# EAGLE design femto-beacon-esp32coin (EAGLE 9.3.0)

## Sheet 1 of 3
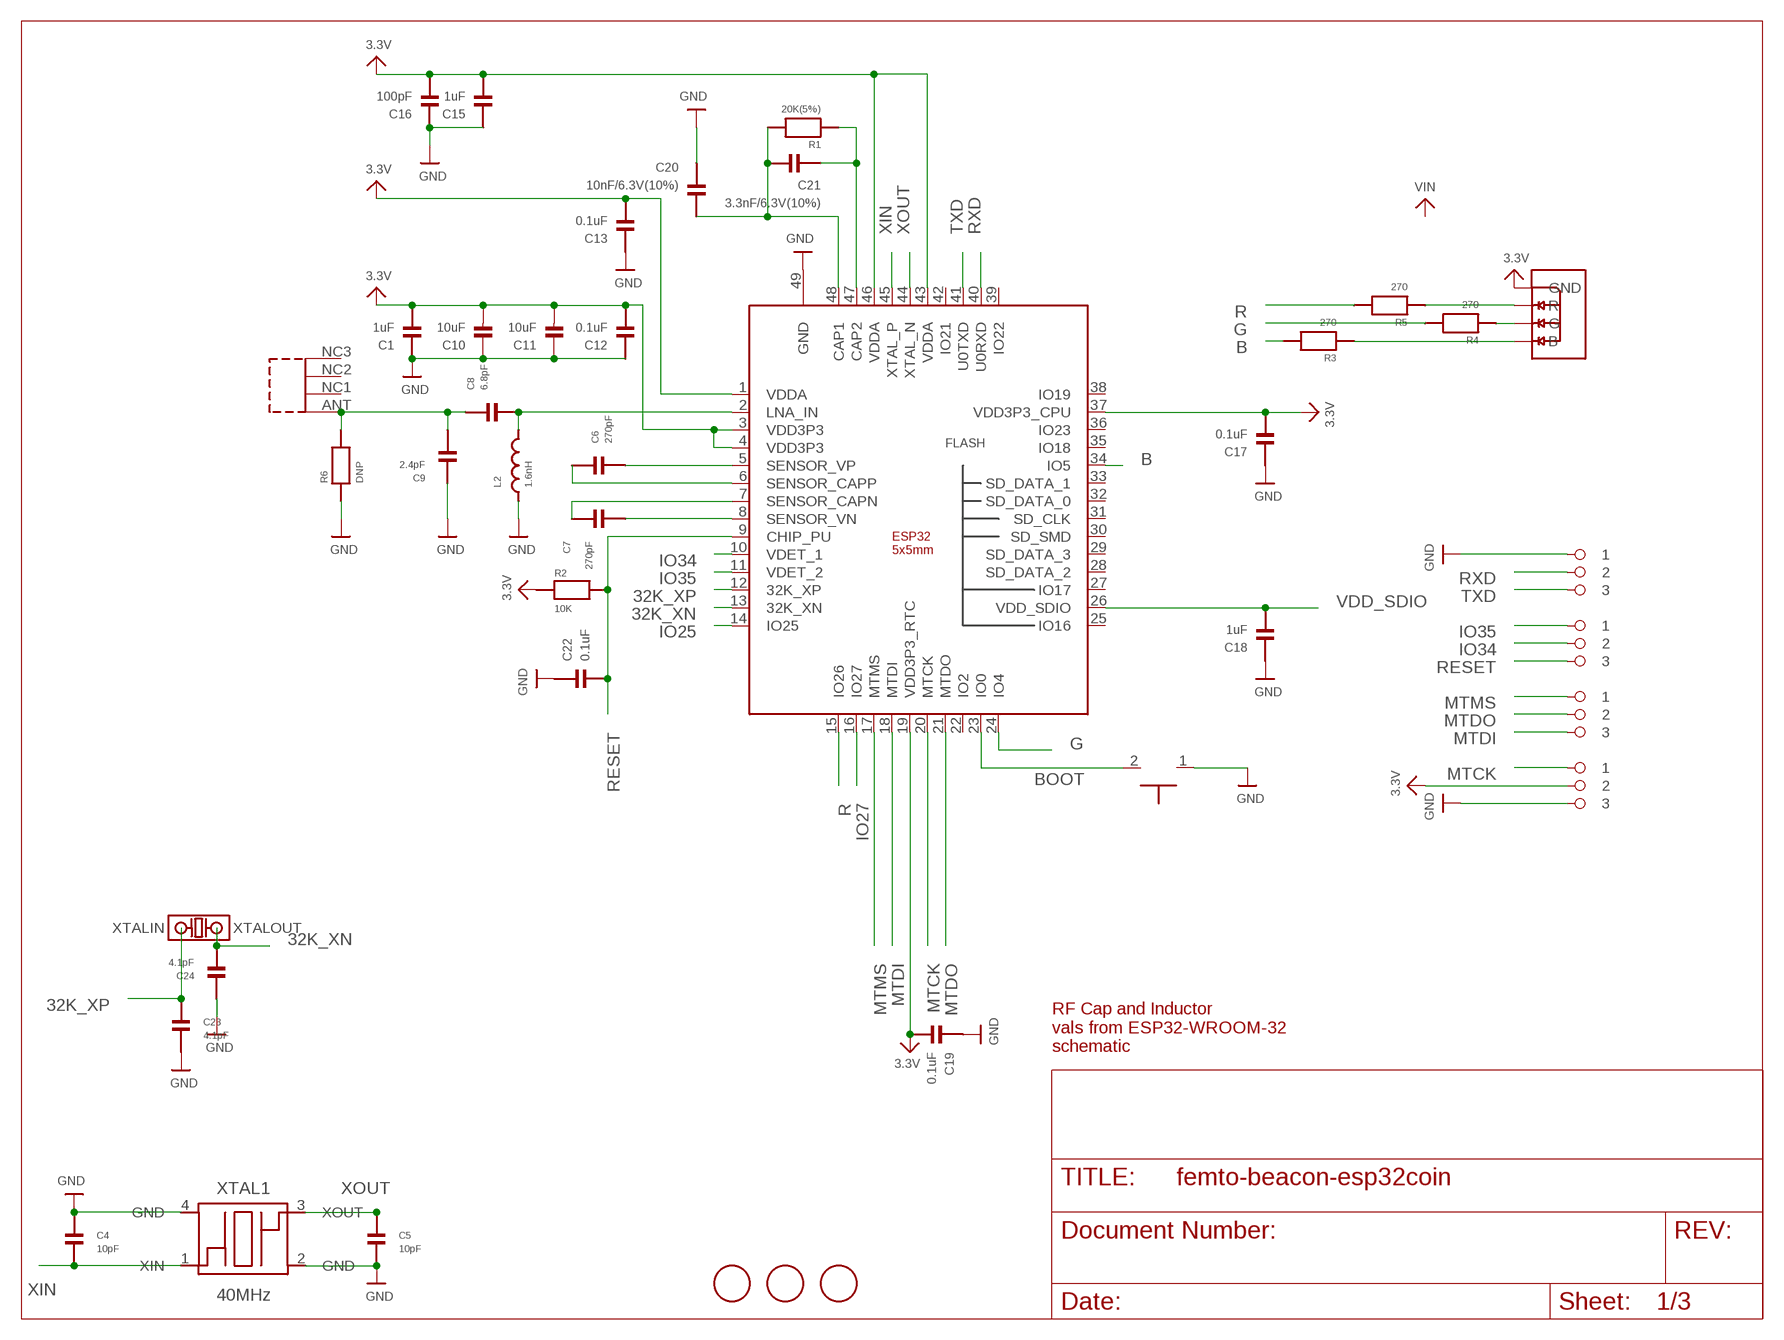
[diagram p0: schematic, sheet 1]

### Parts
ANT1  0479480001  [0479480001]
BOOT1  TACTILE_SWITCH_NO_GND_NO_BOSS  [SIDE_ACT_NO_GND_NO_BOSS]
C1  1uF  CAPACITOR_0201  [PART]
C4  10pF  CAPACITOR_0201  [PART]
C5  10pF  CAPACITOR_0201  [PART]
C6  270pF  CAPACITOR_0201  [PART]
C7  270pF  CAPACITOR_0201  [PART]
C8  6.8pF  CAPACITOR_0201  [PART]
C9  2.4pF  CAPACITOR_0201  [PART]
C10  10uF  CAP_CERAMIC_0603MP  [_0603MP]
C11  10uF  CAP_CERAMIC_0603MP  [_0603MP]
C12  0.1uF  CAPACITOR_0201  [PART]
C13  0.1uF  CAPACITOR_0201  [PART]
C15  1uF  CAPACITOR_0201  [PART]
C16  100pF  CAPACITOR_0201  [PART]
C17  0.1uF  CAPACITOR_0201  [PART]
C18  1uF  CAPACITOR_0201  [PART]
C19  0.1uF  CAPACITOR_0201  [PART]
C20  10nF/6.3V(10%)  CAPACITOR_0201  [PART]
C21  3.3nF/6.3V(10%)  CAPACITOR_0201  [PART]
C22  0.1uF  CAPACITOR_0201  [PART]
C23  4.1pF  CAPACITOR_0201  [PART]
C24  4.1pF  CAPACITOR_0201  [PART]
FID1  FIDUCIAL  [FIDUCIAL_1MM]
FID2  FIDUCIAL  [FIDUCIAL_1MM]
FID3  FIDUCIAL  [FIDUCIAL_1MM]
IC1  ESP32-QFN_5X5  [ESP32-QFN48_5X5]
L2  1.6nH  INDUCTOR_FIXED_0201  [PART]
PIN_EN  1X3_ROUND  [1X3_ROUND]
PIN_GPIO_A  1X3_ROUND  [1X3_ROUND]
PIN_GPIO_B  1X3_ROUND  [1X3_ROUND]
PIN_UART  1X3_ROUND  [1X3_ROUND]
R1  20K(5%)  RESISTOR_0201  [PART]
R2  10K  RESISTOR_0201  [PART]
R3  270  RESISTOR_0201  [PART]
R4  270  RESISTOR_0201  [PART]
R5  270  RESISTOR_0201  [PART]
R6  DNP  RESISTOR_0201  [PART]
RGB1  LRTB_R48G  [LRTB_R48G]
XTAL1  40MHz  FA-128  [FA-128]
XTAL2  ABS06-107-32.768KHZ-T  [ABS06-107-32.768KHZ-T]

### Nets
3.3V: C1.2 C10.2 C11.2 C12.2 C13.2 C15.2 C16.2 C17.2 C19.2 IC1.1(VDDA) IC1.3(VDD3P3) IC1.4(VDD3P3) IC1.19(VDD3P3_RTC) IC1.37(VDD3P3_CPU) IC1.43(VDDA) IC1.46(VDDA) PIN_GPIO_A.P$2 R2.1 RGB1.1(GND) ; also sheet 2
32K_XN: C24.1 IC1.13(32K_XN) XTAL2.2(XTALOUT)
32K_XP: C23.2 IC1.12(32K_XP) XTAL2.1(XTALIN)
ANT: C8.2 IC1.2(LNA_IN) L2.2
B: IC1.34(IO5) R3.2
B_: R3.1 RGB1.4(B)
BOOT: BOOT1.2 IC1.23(IO0)
G: IC1.24(IO4) R4.2
G_: R4.1 RGB1.3(G)
GND: BOOT1.1 C1.1 C4.1 C5.1 C9.1 C10.1 C11.1 C12.1 C13.1 C15.1 C16.1 C17.1 C18.1 C19.1 C20.1 C22.1 C23.1 C24.2 IC1.49(GND) L2.1 PIN_GPIO_A.P$3 PIN_UART.P$1 R6.1 XTAL1.2(GND) XTAL1.4(GND) ; also sheet 2
IO25: IC1.14(IO25)
IO27: IC1.16(IO27)
IO34: IC1.10(VDET_1) PIN_EN.P$2
IO35: IC1.11(VDET_2) PIN_EN.P$1
MTCK: IC1.20(MTCK) PIN_GPIO_A.P$1
MTDI: IC1.18(MTDI) PIN_GPIO_B.P$3
MTDO: IC1.21(MTDO) PIN_GPIO_B.P$2
MTMS: IC1.17(MTMS) PIN_GPIO_B.P$1
N$1: C6.1 IC1.5(SENSOR_VP)
N$2: C6.2 IC1.6(SENSOR_CAPP)
N$3: C7.2 IC1.8(SENSOR_VN)
N$4: C7.1 IC1.7(SENSOR_CAPN)
N$6: ANT1.ANT C8.1 C9.2 R6.2
N$7: C21.2 IC1.47(CAP2) R1.1
N$9: C20.2 C21.1 IC1.48(CAP1) R1.2
R: IC1.15(IO26) R5.2
R_: R5.1 RGB1.2(R)
RESET: C22.2 IC1.9(CHIP_PU) PIN_EN.P$3 R2.2
RXD: IC1.40(U0RXD) PIN_UART.P$2
TXD: IC1.41(U0TXD) PIN_UART.P$3
VDD_SDIO: C18.2 IC1.26(VDD_SDIO)
XIN: C4.2 IC1.45(XTAL_P) XTAL1.1(XIN)
XOUT: C5.2 IC1.44(XTAL_N) XTAL1.3(XOUT)
Unconnected: ANT1.NC1 ANT1.NC2 ANT1.NC3 IC1.22(IO2) IC1.25(IO16) IC1.27(IO17) IC1.28(SD_DATA_2) IC1.29(SD_DATA_3) IC1.30(SD_SMD) IC1.31(SD_CLK) IC1.32(SD_DATA_0) IC1.33(SD_DATA_1) IC1.35(IO18) IC1.36(IO23) IC1.38(IO19) IC1.39(IO22) IC1.42(IO21)

### Notes on the sheet
- RF Cap and Inductor
  vals from ESP32-WROOM-32
  schematic

## Sheet 2 of 3
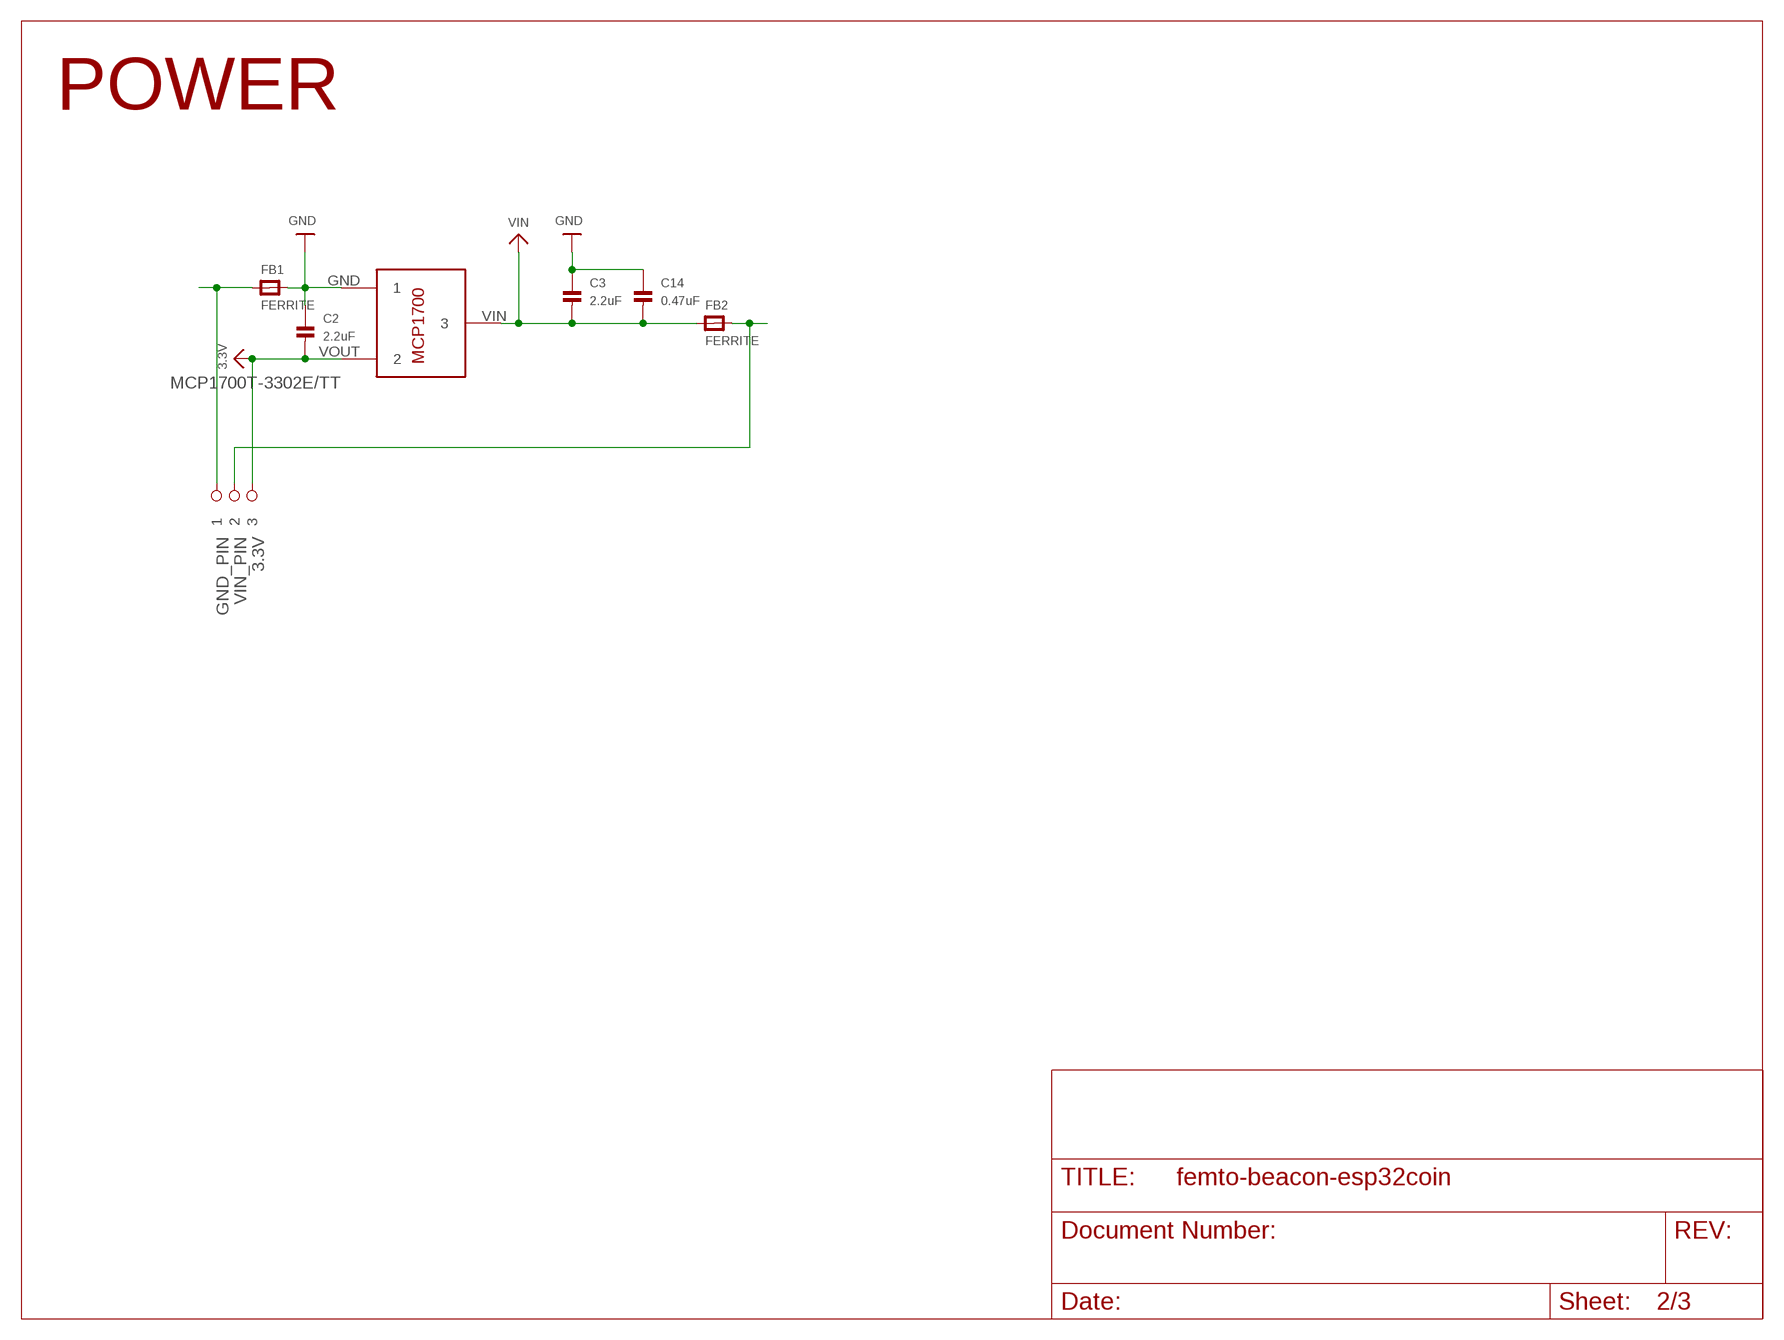
[diagram p1: schematic, sheet 2]

### Parts
C2  2.2uF  CAP_CERAMIC_0402MP  [_0402MP]
C3  2.2uF  CAP_CERAMIC_0402MP  [_0402MP]
C14  0.47uF  CAP_CERAMIC_0402MP  [_0402MP]
FB1  FERRITE  FERRITE_0603MP  [_0603MP]
FB2  FERRITE  FERRITE_0603MP  [_0603MP]
LDO1  MCP1700T-3302E/TT  [MCP1700T-3302E/TT]
PIN_PWR  1X3_ROUND  [1X3_ROUND]

### Nets
3.3V: C2.2 LDO1.VOUT PIN_PWR.P$3 ; also sheet 1
GND: C2.1 C3.1 C14.1 FB1.2 LDO1.GND ; also sheet 1
GND_PIN: FB1.1 PIN_PWR.P$1
VIN: C3.2 C14.2 FB2.1 LDO1.VIN
VIN_PIN: FB2.2 PIN_PWR.P$2

### Notes on the sheet
- POWER

## Sheet 3 of 3
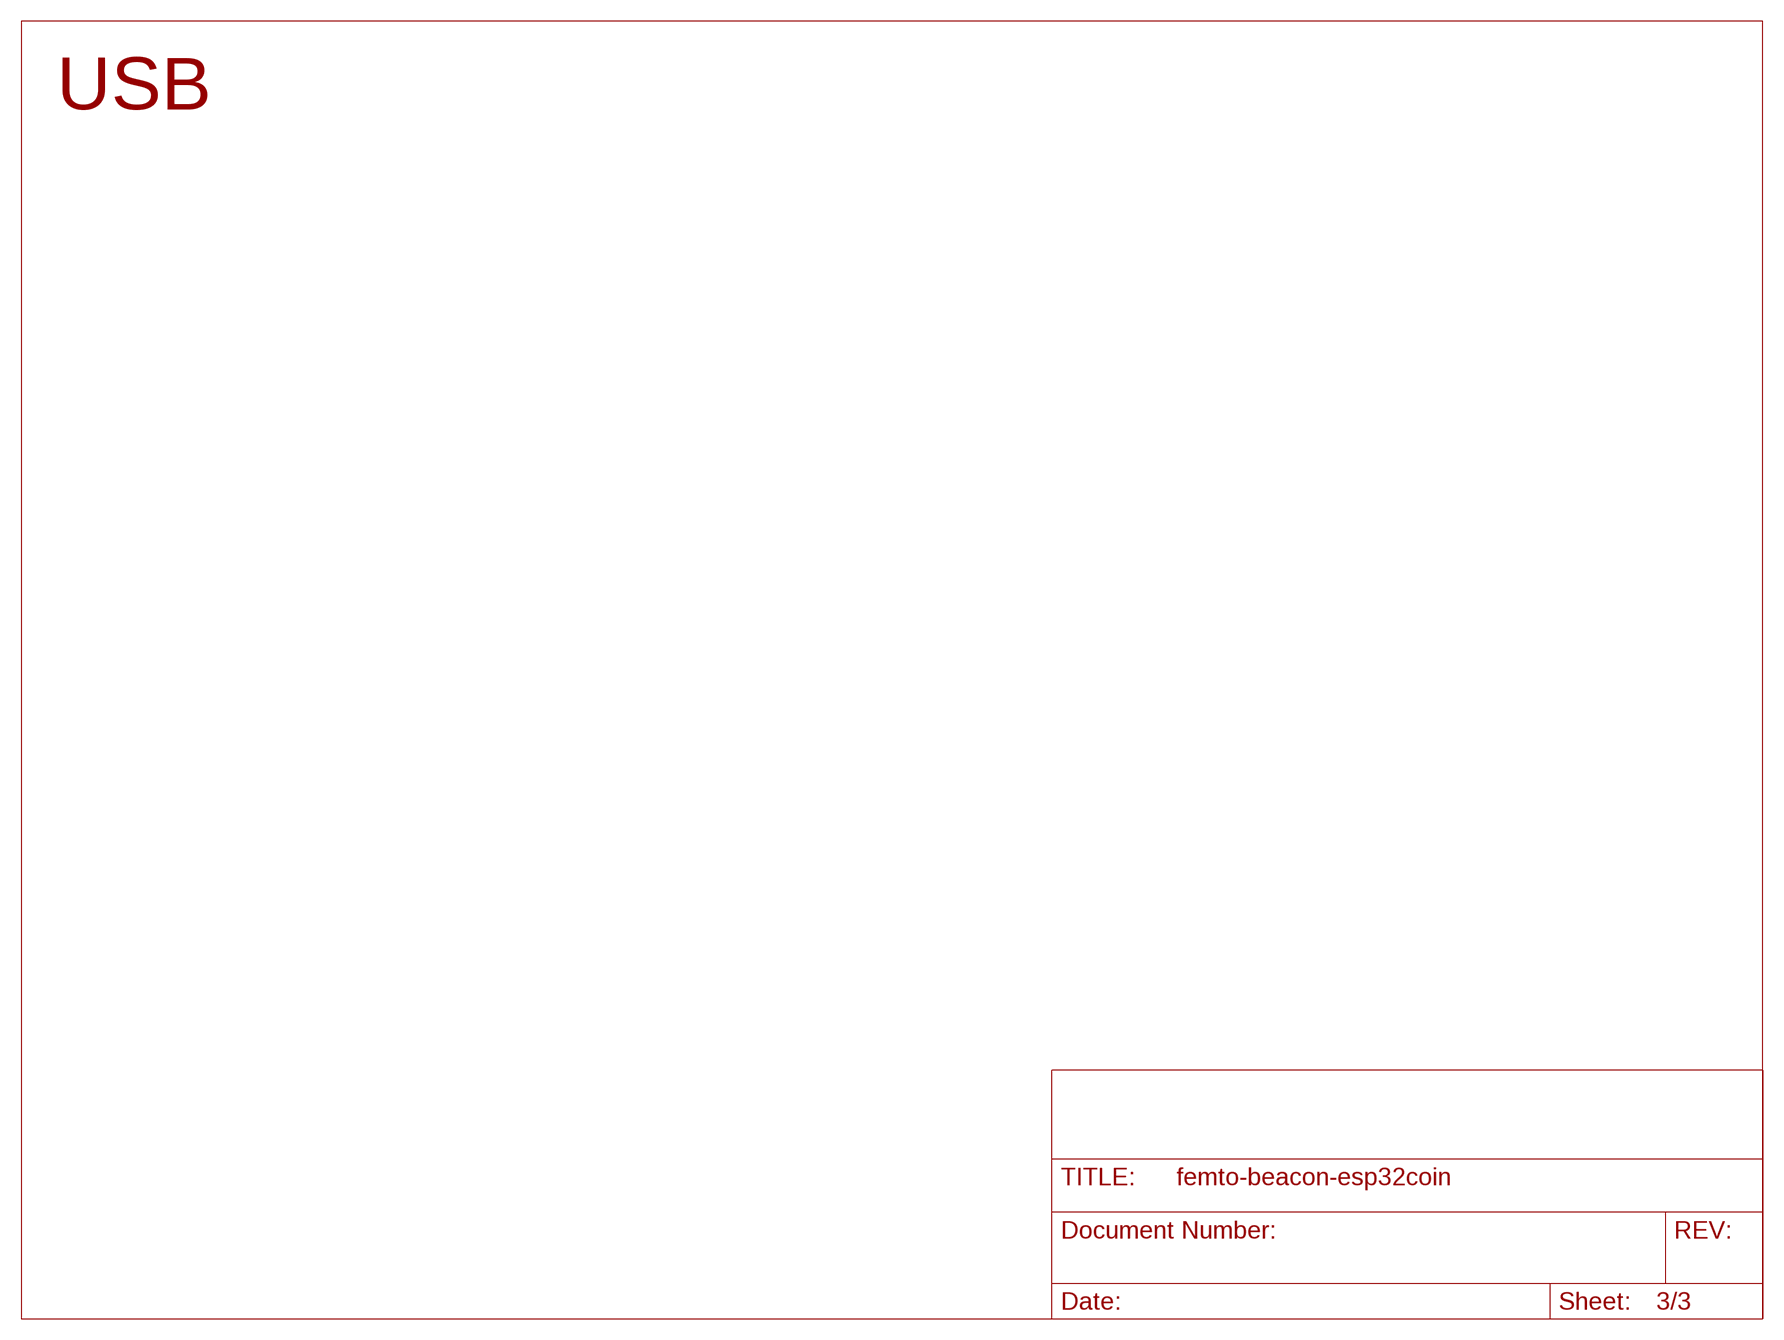
[diagram p2: schematic, sheet 3]

### Notes on the sheet
- USB

## Library data of the parts
ANT1 = molex-antenna-2.4GHz:0479480001: Molex 2.4GHz SMD tower antenna.; MPN: 0479480001
BOOT1 = omron_tactile_switch:TACTILE_SWITCH_NO_GND_NO_BOSS: Omron tactile switch; MPN: B3U-3000P
C1 C15 C18 = parts_0201:CAPACITOR_0201; MPN: CL03A105KQ3CSNH
C2 C3 = microbuilder:CAP_CERAMIC: Ceramic Capacitors 0402 - 0402 Surface Mount Capacitors 16pF 50V 5% [Digikey: 445-4899-2-ND] 18pF 50V 5% [Digikey: 490-1281-2-ND] 22pF 50V 5% [Digikey: 490-1283-2-ND] 68pF 50V 5% [Digikey: 490-1289-2-ND] 0.1uF 10V 10% [Digikey: 490-1318-2-ND] 1.0uF 6.3V 10% [Digikey: 490-1320-2-ND] 0603 - 0603 Surface Mount Capacitors 16 pF 50V 5% [Digikey: 445-5051-2-ND] 22 pF 50V [Digikey: PCC220ACVTR-ND] 33 pF 50V 5% [Digikey: 490-1415-1-ND] 56pF 50V 5% [Digikey: 490-1421-1-ND] 220pF 50V 5% [Digikey: 445-1285-1-ND] 680 pF 50V 2200 pF 50V 5% C0G [Digikey: 445-1297-1-ND] 5600 pF 100V 5% X7R [Digikey: 478-3711-1-ND] 0.1 µF 25V 10% [Digikey: PCC2277TR-ND] 0.22 µF 16V 10% X7R [Digikey: 445-1318-1-ND] 1.0 µF 25V 10% [Digikey: 445-5146-2-ND] 0603 - RF Specific 3pF 250V +/-0.1pF RF [Digikey: 712-1347-1-ND] 18 pF 250V 5% [Digikey: 478-3505-1-ND or 712-1322-1-ND] 56 pF 250V 5% C0G RF [Digikey: 490-4867-1-ND] 68 pF 250V RF [Digikey: 490-4868-1-ND] 0805 - 0805 Surface Mount Capacitors 220 pF 250V 2% RF Ceramic Capacitor [Digikey: 712-1398-1-ND] 1000 pF 50V 2% NP0 Ceramic Capacitor [Digikey: 478-3760-1-ND] 0.1 µF 25V 10% Ceramic Capacitor [Digikey: PCC1828TR-ND] 1.0 µF 16V 10% Ceramic Capacitor[Digikey: 490-1691-2-ND] 10.0 µF 10V 10% Ceramic Capacitor[Digikey: 709-1228-1-ND] 10.0 uF 16V 10% Ceramic Capacitor [Digikey: 478-5165-2-ND] 47 uF 6.3V 20% Ceramic Capacitor [Digikey: 587-1779-1-ND or 399-5506-1-ND] 1206 - 1206 Surface Mount Capacitors 47uF 10V 20% Ceramic Capacitor [Digikey: 490-5528-1-ND or 399-5508-1-ND or 445-6010-1-ND] 100uF 6.3V -20%, +80% Y5V Ceramic Capacitor (Digikey: 490-4512-1-ND, Mouser: 81-GRM31CF50J107ZE1L); MPN: C1005X5R0J225K050BC
C4 C5 = parts_0201:CAPACITOR_0201; MPN: 02013A100JAT2A
C6 C7 = parts_0201:CAPACITOR_0201; MPN: GRM033R71C271KA01D
C8 = parts_0201:CAPACITOR_0201; MPN: GRM0335C2A6R8DA01D
C9 = parts_0201:CAPACITOR_0201; MPN: GRM0335C1H2R4CA01D
C10 C11 = microbuilder:CAP_CERAMIC: Ceramic Capacitors 0402 - 0402 Surface Mount Capacitors 16pF 50V 5% [Digikey: 445-4899-2-ND] 18pF 50V 5% [Digikey: 490-1281-2-ND] 22pF 50V 5% [Digikey: 490-1283-2-ND] 68pF 50V 5% [Digikey: 490-1289-2-ND] 0.1uF 10V 10% [Digikey: 490-1318-2-ND] 1.0uF 6.3V 10% [Digikey: 490-1320-2-ND] 0603 - 0603 Surface Mount Capacitors 16 pF 50V 5% [Digikey: 445-5051-2-ND] 22 pF 50V [Digikey: PCC220ACVTR-ND] 33 pF 50V 5% [Digikey: 490-1415-1-ND] 56pF 50V 5% [Digikey: 490-1421-1-ND] 220pF 50V 5% [Digikey: 445-1285-1-ND] 680 pF 50V 2200 pF 50V 5% C0G [Digikey: 445-1297-1-ND] 5600 pF 100V 5% X7R [Digikey: 478-3711-1-ND] 0.1 µF 25V 10% [Digikey: PCC2277TR-ND] 0.22 µF 16V 10% X7R [Digikey: 445-1318-1-ND] 1.0 µF 25V 10% [Digikey: 445-5146-2-ND] 0603 - RF Specific 3pF 250V +/-0.1pF RF [Digikey: 712-1347-1-ND] 18 pF 250V 5% [Digikey: 478-3505-1-ND or 712-1322-1-ND] 56 pF 250V 5% C0G RF [Digikey: 490-4867-1-ND] 68 pF 250V RF [Digikey: 490-4868-1-ND] 0805 - 0805 Surface Mount Capacitors 220 pF 250V 2% RF Ceramic Capacitor [Digikey: 712-1398-1-ND] 1000 pF 50V 2% NP0 Ceramic Capacitor [Digikey: 478-3760-1-ND] 0.1 µF 25V 10% Ceramic Capacitor [Digikey: PCC1828TR-ND] 1.0 µF 16V 10% Ceramic Capacitor[Digikey: 490-1691-2-ND] 10.0 µF 10V 10% Ceramic Capacitor[Digikey: 709-1228-1-ND] 10.0 uF 16V 10% Ceramic Capacitor [Digikey: 478-5165-2-ND] 47 uF 6.3V 20% Ceramic Capacitor [Digikey: 587-1779-1-ND or 399-5506-1-ND] 1206 - 1206 Surface Mount Capacitors 47uF 10V 20% Ceramic Capacitor [Digikey: 490-5528-1-ND or 399-5508-1-ND or 445-6010-1-ND] 100uF 6.3V -20%, +80% Y5V Ceramic Capacitor (Digikey: 490-4512-1-ND, Mouser: 81-GRM31CF50J107ZE1L); MPN: GRM188R61C106KAALD
C12 C13 C17 C19 C22 = parts_0201:CAPACITOR_0201; MPN: GRM033C80J104KE84D
C14 = microbuilder:CAP_CERAMIC: Ceramic Capacitors 0402 - 0402 Surface Mount Capacitors 16pF 50V 5% [Digikey: 445-4899-2-ND] 18pF 50V 5% [Digikey: 490-1281-2-ND] 22pF 50V 5% [Digikey: 490-1283-2-ND] 68pF 50V 5% [Digikey: 490-1289-2-ND] 0.1uF 10V 10% [Digikey: 490-1318-2-ND] 1.0uF 6.3V 10% [Digikey: 490-1320-2-ND] 0603 - 0603 Surface Mount Capacitors 16 pF 50V 5% [Digikey: 445-5051-2-ND] 22 pF 50V [Digikey: PCC220ACVTR-ND] 33 pF 50V 5% [Digikey: 490-1415-1-ND] 56pF 50V 5% [Digikey: 490-1421-1-ND] 220pF 50V 5% [Digikey: 445-1285-1-ND] 680 pF 50V 2200 pF 50V 5% C0G [Digikey: 445-1297-1-ND] 5600 pF 100V 5% X7R [Digikey: 478-3711-1-ND] 0.1 µF 25V 10% [Digikey: PCC2277TR-ND] 0.22 µF 16V 10% X7R [Digikey: 445-1318-1-ND] 1.0 µF 25V 10% [Digikey: 445-5146-2-ND] 0603 - RF Specific 3pF 250V +/-0.1pF RF [Digikey: 712-1347-1-ND] 18 pF 250V 5% [Digikey: 478-3505-1-ND or 712-1322-1-ND] 56 pF 250V 5% C0G RF [Digikey: 490-4867-1-ND] 68 pF 250V RF [Digikey: 490-4868-1-ND] 0805 - 0805 Surface Mount Capacitors 220 pF 250V 2% RF Ceramic Capacitor [Digikey: 712-1398-1-ND] 1000 pF 50V 2% NP0 Ceramic Capacitor [Digikey: 478-3760-1-ND] 0.1 µF 25V 10% Ceramic Capacitor [Digikey: PCC1828TR-ND] 1.0 µF 16V 10% Ceramic Capacitor[Digikey: 490-1691-2-ND] 10.0 µF 10V 10% Ceramic Capacitor[Digikey: 709-1228-1-ND] 10.0 uF 16V 10% Ceramic Capacitor [Digikey: 478-5165-2-ND] 47 uF 6.3V 20% Ceramic Capacitor [Digikey: 587-1779-1-ND or 399-5506-1-ND] 1206 - 1206 Surface Mount Capacitors 47uF 10V 20% Ceramic Capacitor [Digikey: 490-5528-1-ND or 399-5508-1-ND or 445-6010-1-ND] 100uF 6.3V -20%, +80% Y5V Ceramic Capacitor (Digikey: 490-4512-1-ND, Mouser: 81-GRM31CF50J107ZE1L); MPN: GRM155R60J474KE19D
C16 = parts_0201:CAPACITOR_0201; MPN: 0201YC101KAT2A
C20 = parts_0201:CAPACITOR_0201; MPN: GRM033R70J103KA01D
C21 = parts_0201:CAPACITOR_0201; MPN: GRM033R70J332KA01D
C23 C24 = parts_0201:CAPACITOR_0201; MPN: GRM0335C1H4R1BA01D
FB1 FB2 = microbuilder:FERRITE: Ferrite Bead 0603 MMZ1608B121C - 120 Ohm @ 100MHz, 600mA, 0.15 Ohm DC Resistance - Digikey: 445-2164-1-ND BK1608HW121-T - 120 Ohm, 600mA Ferrite Chip - Digikey: 587-1876-2-ND 0805 HZ0805B272R-10 - 2.7K Ohm @ 100MHz, 200mA, 0.8 Ohm DC Resistance - Digikey: 240-2504-1-ND (see also Murata BLM21BD272SN1L) MMZ2012Y152B - 1.5K Ohm @ 100MHz, 500mA, 0.4 Ohm DC Resistance - Digikey: 445-1560-1-ND - Mainly for high frequency (80-400MHz) MMZ2012R102A - 1K Ohm @ 100MHz, 500mA, 0.3 Ohm DC Resistance - Digikey: 445-1555-2-ND - More general purpose (10-200MHz); MPN: BLM18RK102SN1D
FID1-FID3 = adafruit:FIDUCIAL: For use by pick and place machines to calibrate the vision/machine, 1mm By microbuilder.eu
IC1 = esp32-wroom-32:ESP32-QFN_5X5: ESP32-D2WD - has 2 MiB internal flash ESP32-S0WD - has 0 MiB internal flash (requires external SPI flash); MPN: ESP32-D2WD
L2 = parts_0201:INDUCTOR_FIXED_0201; MPN: LQP03HQ1N6B02D
LDO1 = MCP1700T-3302E_TT:MCP1700T-3302E/TT: Microchip LDO "MCP1700" in a 3-Pin SOT-23 package. ID: MCP1700T-3302E/TT; MPN: MCP1700T-3302E/TT
PIN_EN PIN_GPIO_A PIN_GPIO_B PIN_PWR PIN_UART = pins_1.27mm_pitch:1X3_ROUND
R1 = parts_0201:RESISTOR_0201; MPN: RC0201JR-0720KL
R2 = parts_0201:RESISTOR_0201; MPN: RC0201JR-0710KL
R3-R5 = parts_0201:RESISTOR_0201; MPN: RC0201FR-07270RL
R6 = parts_0201:RESISTOR_0201
RGB1 = osram_opto_LED:LRTB_R48G: OSRAM RGB LED; MPN: LRTB R48G
XTAL1 = crystals:FA-128; MPN: FA-128 40.0000MF10Z-K3
XTAL2 = crystals:ABS06-107-32.768KHZ-T: ABS06-107-32.768kHz-T Crystal Oscillator; MPN: ABS06-107-32.768kHz-T

## Board
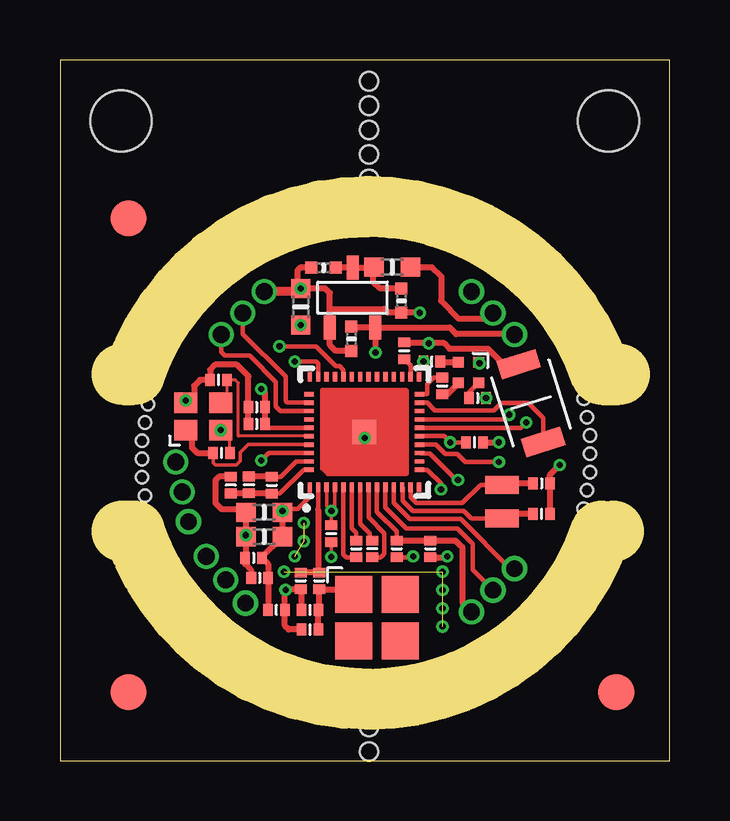
[diagram p3: board, top side]
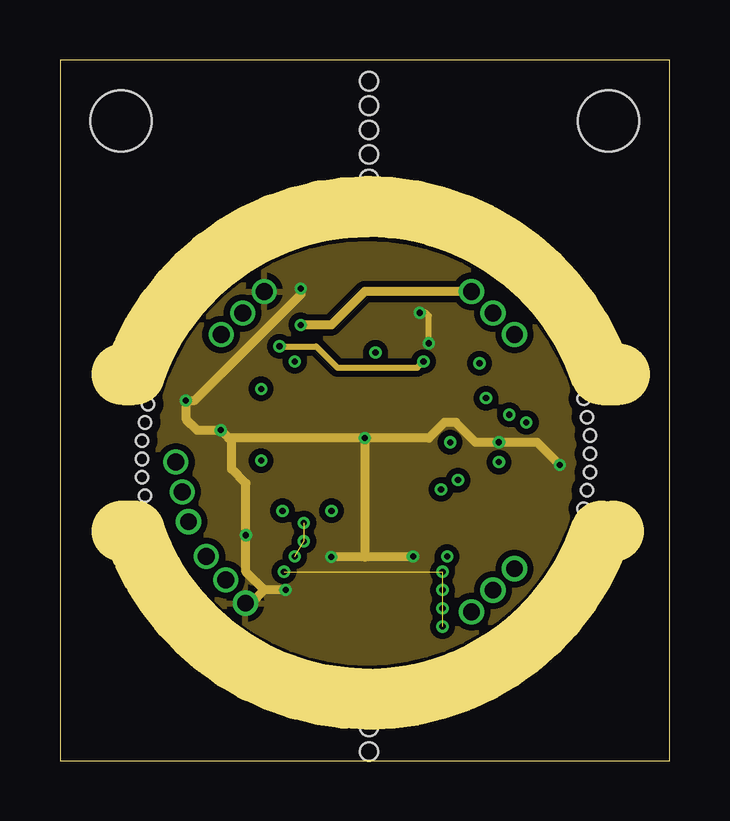
[diagram p4: board, inner layer Route2]
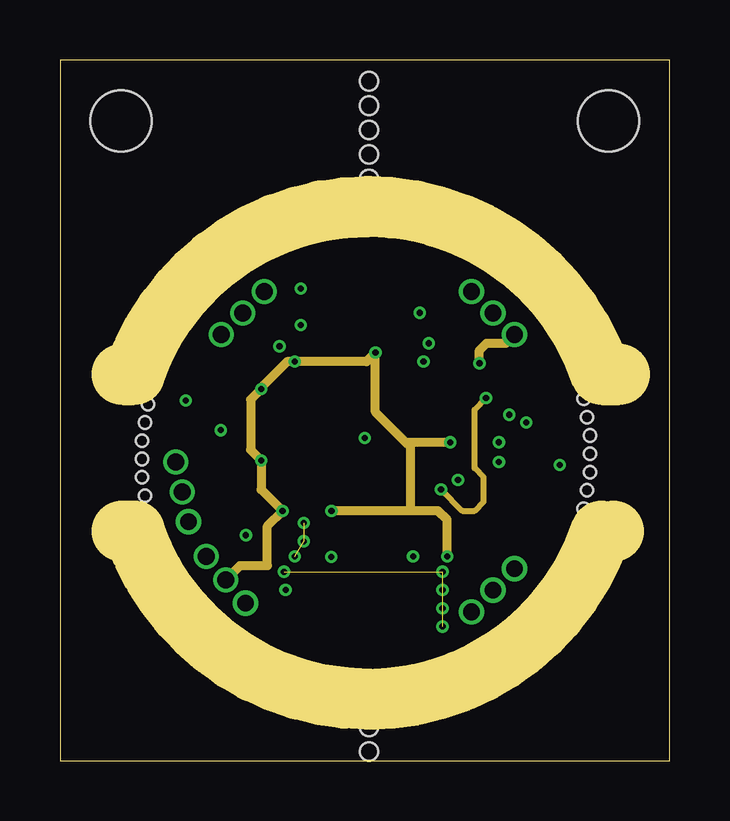
[diagram p5: board, inner layer Route15]
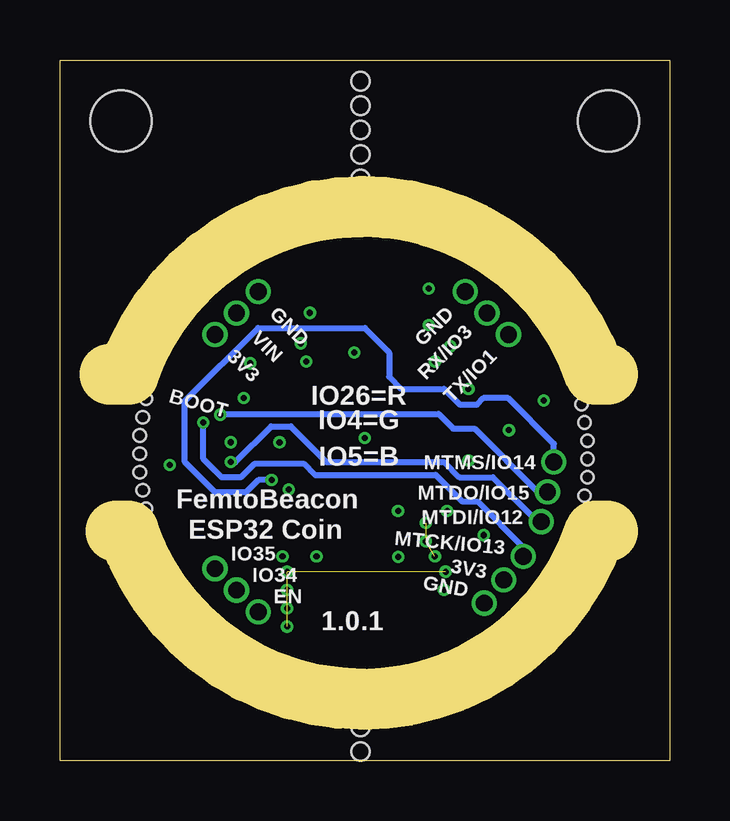
[diagram p6: board, bottom side, seen from below]

Size 25.4 x 29.21 mm. Coordinates in mm from the lower left corner, seen from the top.
Outline: 0,0 25.4,0 25.4,29.21 0,29.21 0,0
Copper layers (1*2*15*16): Top 0.035559375mm / dielectric 0.17018125mm / Route2 0.01778125mm / dielectric 47mil / Route15 0.01778125mm / dielectric 0.17018125mm / Bottom 0.035559375mm
Design rules "oshpark-4layer *": minimum track width 5mil, minimum drill 10mil, track to track 6mil, track to pad 6mil, pad to pad 6mil, via to via 6mil, smd to smd 5mil, copper to edge 15mil, drill to drill 6mil, minimum pad ring 4mil, minimum via ring 4mil, stop-mask expansion 2.5mil, vias tented up to drill 10mil, thermal gap 10mil
Holes 0.51 mm at 22.08,12.79 21.82,15.08 22.08,13.55 22.08,12.03 21.95,14.32 21.82,10.51 21.95,11.27 3.41,12.57 3.67,10.29 3.41,11.81 3.41,13.34 3.54,11.05 3.67,14.86 3.54,14.1
Holes 0.76 mm at 12.87,0.38 12.87,24.26 12.87,1.4 12.87,25.27 12.87,26.29 12.87,27.3 12.87,28.32
Holes 2.54 mm at 22.86,26.67 2.54,26.67
Milling: 8 lines

### Footprints (pad centres in the part's own frame; a part is rotated, then mirrored left to right if it is on the bottom)
0479480001 = smd 1.54 x 1.54: ANT -0.963,0.963; NC1 0.978,0.963; NC2 0.978,-0.978; NC3 -0.963,-0.978
SIDE_ACT_NO_GND_NO_BOSS = smd 0.8 x 1.7: 1 -1.7,0; 2 1.7,0
PART = smd 0.4 x 0.5: 1 -0.35,0; 2 0.35,0
_0402MP = smd 0.5 x 0.5: 1 -0.508,0; 2 0.508,0
_0603MP = smd 0.8 x 0.8: 1 -0.762,0; 2 0.762,0
FIDUCIAL_1MM = smd 1.5 x 1.5: 1 0,0
ESP32-QFN48_5X5 = smd 0.18 x 0.4: 1 -2.275,-2.3; 2 -1.925,-2.3; 3 -1.575,-2.3; 4 -1.225,-2.3; 5 -0.875,-2.3; 6 -0.525,-2.3; 7 -0.175,-2.3; 8 0.175,-2.3; 9 0.525,-2.3; 10 0.875,-2.3; 11 1.225,-2.3; 12 1.575,-2.3; 13 1.925,-2.3; 14 2.275,-2.3; 25 2.275,2.3; 26 1.925,2.3; 27 1.575,2.3; 28 1.225,2.3; 29 0.875,2.3; 30 0.525,2.3; 31 0.175,2.3; 32 -0.175,2.3; 33 -0.525,2.3; 34 -0.875,2.3; 35 -1.225,2.3; 36 -1.575,2.3; 37 -1.925,2.3; 38 -2.275,2.3 | smd 0.4 x 0.18: 15 2.3,-1.575; 16 2.3,-1.225; 17 2.3,-0.875; 18 2.3,-0.525; 19 2.3,-0.175; 20 2.3,0.175; 21 2.3,0.525; 22 2.3,0.875; 23 2.3,1.225; 24 2.3,1.575; 39 -2.3,1.575; 40 -2.3,1.225; 41 -2.3,0.875; 42 -2.3,0.525; 43 -2.3,0.175; 44 -2.3,-0.175; 45 -2.3,-0.525; 46 -2.3,-0.875; 47 -2.3,-1.225; 48 -2.3,-1.575 | smd 1 x 1: 49 0,0
MCP1700T-3302E/TT = smd 0.5 x 1: GND -0.95,-1.25; VIN 0,1.25; VOUT 0.95,-1.25
1X3_ROUND = drill 0.7 pad 1: P$1 0,0; P$2 0,-1.27; P$3 0,-2.54
LRTB_R48G = smd 0.45 x 0.45: 1 0.425,0.425; 2 0.425,-0.425; 3 -0.425,-0.425; 4 -0.425,0.425
FA-128 = smd 0.95 x 0.85: 1 -0.725,-0.575; 2 0.725,-0.575; 3 0.725,0.575; 4 -0.725,0.575
ABS06-107-32.768KHZ-T = smd 0.75 x 1.4: 1 -0.7,0; 2 0.7,0

### Placement (x,y rotation side)
ANT1  13.21,5.97 0 top
BOOT1  19.62,14.91 287.5 top
C1  8.06,8.45 0 top
C2  12.14,17.59 90 top
C3  10.99,20.55 0 top
C4  6.73,12.83 180 top
C5  6.6,15.88 0 top
C6  12.34,8.83 90 top
C7  13.02,8.83 270 top
C8  10.79,7.49 90 top
C9  10.41,6.29 0 top
C10  8.51,10.35 0 top
C11  8.51,9.33 0 top
C12  8.32,7.62 0 top
C13  9.02,6.29 180 top
C14  14.22,19.18 90 top
C15  8.2,14.03 0 top
C16  8.2,14.73 0 top
C17  11.3,9.46 90 top
C18  14.35,17.08 270 top
C19  17.27,13.27 180 top
C20  7.11,11.49 270 top
C21  8.83,11.48 90 top
C22  14.03,8.83 90 top
C23  20.07,10.29 180 top
C24  20.07,11.56 0 top
FB1  10.03,18.92 90 top
FB2  13.84,20.57 0 top
FID1  2.86,2.86 0 top
FID2  2.86,22.61 0 top
FID3  23.18,2.86 0 top
IC1  12.68,13.7 0 top
L2  10.03,7.49 90 top
LDO1  12.19,19.3 0 top
PIN_EN  18.94,8 315 top
PIN_GPIO_A  6.1,8.51 40 top
PIN_GPIO_B  4.83,12.45 12 top
PIN_PWR  17.14,19.56 45 top
PIN_UART  8.51,19.56 315 top
R1  7.87,11.49 270 top
R2  15.43,8.83 90 top
R3  15.49,16.64 180 top
R4  15.93,15.62 90 top
R5  17.4,15.11 0 top
R6  10.41,5.46 0 top
RGB1  17.02,16.18 0 top
XTAL1  5.97,14.35 0 top
XTAL2  18.41,10.79 90 top

### Tracks (layer width: path | path; a pad name or v marks a point on that pad's centre or on a via)
3.3V  (via drill 0.25 pad 0.51)
  Top 0.152: IC1.3 11.11,10.62 v11.31,10.41 | C17.2 v11.3,10.4 v11.31,10.41 | v11.31,10.41 11.46,10.56 IC1.4
  Top 0.178: IC1.19 16,13.52 v16.26,13.27 C19.2 | IC1.46 8.7,12.82 v8.38,12.51 | IC1.43 8.71,13.87 C15.2 | IC1.37 10.76,16.55 10.67,16.64 v9.78,16.64 | C10.2 9.41,10.49 9.91,10.49 10.41,10.99 IC1.1
  Top 0.254: LDO1.VOUT 12.19,18.05 C2.2 | C13.2 C12.2 8.67,8.19 C1.2 8.41,8.48 C11.2 C10.2 v9.27,10.41 | C15.2 C16.2 8.55,15.33 v8.38,15.49 | LDO1.VOUT v13.14,17.02 | LDO1.VOUT 16.24,18.05 16.51,17.78 18.92,17.78 PIN_PWR.P$3 | R2.1 16.1,8.48 v16.13,8.51 | v17.48,16.56 RGB1.1
  Route15 0.381: 14.61,10.41 15.75,10.41 16.13,10.03 v16.13,8.51 | 14.61,10.41 v11.31,10.41 | v16.26,13.27 14.42,13.27 | 14.42,13.27 13.14,14.54 v13.14,17.02 12.76,16.64 v9.78,16.64 9.46,16.64 8.38,15.56 v8.38,15.49 7.94,15.05 7.94,12.95 v8.38,12.51 8.38,11.3 v9.27,10.41 8.64,9.78 8.64,8.13 7.5,8.13 PIN_GPIO_A.P$2 | 14.42,13.27 14.61,13.08 14.61,10.41 | v17.48,16.56 17.48,17.1 17.78,17.4 18.58,17.4 PIN_PWR.P$3
32K_XN
  Top 0.178: IC1.13 14.61,10.97 14.84,10.73 16.76,10.73 17.52,11.49 XTAL2.2
  Top 0.254: C24.1 18.48,11.56 XTAL2.2
32K_XP
  Top 0.178: IC1.12 14.28,11.38 14.28,10.83 14.7,10.4 16.83,10.4 17.14,10.1 XTAL2.1
  Top 0.254: C23.2 18.61,10.29 XTAL2.1
ANT
  Top 0.178: IC1.2 10.76,10.45
  Top 0.254: L2.2 C8.2 10.76,7.88 10.76,10.45
B  (via drill 0.25 pad 0.51)
  Top 0.178: IC1.34 11.81,16.28 11.65,16.44 11.5,16.44 10.67,17.27 v9.14,17.27
  Route2 0.254: v9.14,17.27 10.67,17.27 11.56,16.38 14.89,16.38 R3.2
  other vias: 15.14,16.64
B_
  Top 0.254: RGB1.4 15.88,16.61 R3.1
BOOT
  Top 0.178: BOOT1.2 20.13,14.28 19.5,14.91 18.39,14.91 18.08,14.61 15.62,14.61 15.3,14.92 IC1.23
G
  Top 0.178: IC1.24 15.29,15.27 15.31,15.29 15.31,15.7 15.58,15.97 R4.2
G_
  Top 0.254: R4.1 16.14,15.27 16.59,15.73 RGB1.3
GND  (via drill 0.25 pad 0.51)
  Top 0.127: v5.24,15.02 XTAL1.4 | C4.1 7.08,13.39 XTAL1.2
  Top 0.152: C17.1 v11.3,8.49
  Top 0.178: C22.1 14.68,8.48 v14.71,8.51
  Top 0.254: XTAL1.4 5.59,15.27 5.59,15.62 5.84,15.88 C5.1 6.25,16.29 6.48,16.51 7.37,16.51 7.85,16.03 C16.1 C15.1 | C9.1 10.06,7.11 L2.1 9.43,7.14 v9.4,7.11 9.37,7.08 C13.1 9.37,5.62 9.53,5.46 R6.1 | C2.1 11.49,17.08 11.24,17.33 LDO1.GND 11.24,18.83 | 11.24,18.83 13.51,18.83 13.67,18.67 C14.1 v14.99,18.67 | 11.24,18.83 11.24,19.49 11.05,19.68 10.16,19.68 FB1.2 9.91,19.81 9.91,20.45 10.01,20.55 C3.1 | C18.1 15.34,17.43 v15.37,17.4 16,17.4 16.24,17.16 17.84,17.16 18.48,16.53 BOOT1.1 | C19.1 v18.29,13.27 | C11.1 C10.1 7.62,10.48 6.73,10.48 6.48,10.73 6.48,11.68 6.63,11.84 C20.1 | C12.1 7.97,7.94 7.71,8.19 C1.1 7.75,8.48 C11.1 | v20.83,12.32 20.42,11.91 C24.2 C23.1 | C11.1 v7.75,9.4
  Top 0.381: IC1.49 12.68,14.08 v12.7,13.45 | 10.16,19.68 10.03,19.56 PIN_UART.P$1
  Route2 0.254: v15.37,17.4 15.37,18.54 15.24,18.67 v14.99,18.67
  Route2 0.381: v12.7,13.45 7.03,13.45 | 7.03,13.45 XTAL1.2 5.71,13.78 5.24,14.25 v5.24,15.02 5.62,15.02 10.03,19.43 FB1.2 | 7.03,13.45 7.15,13.32 7.15,12.15 7.75,11.56 v7.75,9.4 7.75,7.87 8.51,7.11 | v9.4,7.11 8.51,7.11 | v12.7,13.45 15.37,13.45 16.02,14.1 16.49,14.1 17.32,13.27 v18.29,13.27 19.88,13.27 v20.83,12.32 | v14.71,8.51 14.69,8.49 12.7,8.49 | 12.7,8.49 v11.3,8.49 | v12.7,13.45 12.7,8.49 | PIN_GPIO_A.P$3 7.96,6.56 8.51,7.11
  other vias: 6.69,13.78 10.03,19.68
  pour Route2 (isolate 0.254): 4.06,12.81 arc-90 12.81,21.56 arc-90 21.56,12.81 arc-90 12.81,4.06 arc-90
GND_PIN  (via drill 0.25 pad 0.51)
  Route2 0.381: PIN_PWR.P$1 12.7,19.56 11.3,18.16 FB1.1
  other vias: 10.03,18.16
IO34
  Top 0.178: IC1.10 13.56,10.55 14.43,9.68 16.56,9.68 17.2,9.04 17.2,7.95 PIN_EN.P$2
IO35
  Top 0.178: IC1.11 13.91,10.73 14.56,10.07 16.69,10.07 18.77,8 PIN_EN.P$1
MTCK  (via drill 0.25 pad 0.51)
  Top 0.178: IC1.20 19.21,13.87 v19.43,14.1
  Bottom 0.178: 6.1,8.89 PIN_GPIO_A.P$1
  Bottom 0.254: v19.43,14.1 19.43,12.57 18.67,11.81 17.86,11.81 17.31,12.36 15.22,12.36 14.78,11.91 9.75,11.91 8.64,10.79 8,10.79 6.1,8.89
MTDI  (via drill 0.25 pad 0.51)
  Top 0.178: IC1.18 15.65,13.17 16.05,12.78 16.56,12.78 16.89,12.45 v18.29,12.45
  Bottom 0.254: v18.29,12.45 18.09,12.45 16.6,13.93 15.78,13.93 14.3,12.45 9.4,12.45 8.76,11.81 7.37,11.81 5.52,9.96 PIN_GPIO_B.P$3
MTDO  (via drill 0.25 pad 0.51)
  Top 0.178: IC1.21 18.52,14.22 v18.72,14.42
  Bottom 0.254: v18.72,14.42 18.69,14.45 9.63,14.45 9.02,13.84 8.13,13.84 5.49,11.2 PIN_GPIO_B.P$2
MTMS  (via drill 0.25 pad 0.51)
  Top 0.178: v16.58,11.7 16.52,11.7 15.41,12.8 15,12.8 IC1.17
  Bottom 0.254: v16.58,11.7 17.13,11.7 17.65,11.18 18.92,11.18 20.19,12.45 20.19,14.99 17.14,18.03 12.7,18.03 11.68,17.02 11.68,16 11.18,15.49 9.39,15.49 8.73,14.83 8.03,14.83 7.75,15.11 6.73,15.11 4.83,13.21 PIN_GPIO_B.P$1
N$1
  Top 0.178: C6.1 11.94,8.48 11.81,8.6 IC1.5
N$2
  Top 0.178: IC1.6 12.16,9.68 12.34,9.49 C6.2
N$3
  Top 0.178: IC1.8 12.86,10.13 13.51,9.48 13.51,8.62 13.36,8.48 C7.2
N$4
  Top 0.178: IC1.7 12.51,9.87 12.9,9.48 12.9,9.29 C7.1
N$6
  Top 0.254: ANT1.ANT 12.03,7.14 C8.1 10.79,6.32 C9.2 R6.2
N$7
  Top 0.178: IC1.47 9.84,12.47 9.2,11.83 C21.2
  Top 0.254: C21.2 8.81,11.84 R1.1
N$8  (via drill 0.25 pad 0.51)  (2 unrouted)
  other vias: 9.78,8.51 10.16,9.14 10.16,9.91
N$9
  Top 0.178: IC1.48 10.15,12.12 9.16,11.13 C21.1
  Top 0.254: C21.1 8.81,11.14 R1.2 C20.2
N$11  (via drill 0.25 pad 0.51)  (4 unrouted)
  other vias: 9.33,7.87 15.94,7.11 15.94,6.35 15.94,5.59 15.94,7.87
R  (via drill 0.25 pad 0.51)
  Top 0.178: IC1.15 15.31,12.12 15.88,11.56 v15.88,11.3
  Route15 0.254: v15.88,11.3 16.76,10.41 17.27,10.41 17.65,10.79 17.65,11.81 17.27,12.19 17.27,14.64 R5.2
  other vias: 17.75,15.11
R_
  Top 0.178: RGB1.2 17.05,15.36 R5.1
RESET
  Top 0.178: IC1.9 13.21,10.37 14.03,9.55 C22.2
  Top 0.254: C22.2 R2.2 16.48,9.18 16.76,8.89 16.76,6.59 PIN_EN.P$3
RXD
  Top 0.178: IC1.40 9.46,14.92 9.4,14.99 9.4,16 7.61,17.79 PIN_UART.P$2
TXD
  Top 0.178: IC1.41 9.18,14.57 8.99,14.76 8.99,15.79 7.9,16.88 6.87,16.88 6.71,17.04 PIN_UART.P$3
VDD_SDIO
  Top 0.178: IC1.26 14.61,16.47 C18.2
VIN
  Top 0.254: C3.2 11.5,20.55 LDO1.VIN 13.06,20.55 | 13.06,20.55 FB2.1 | C14.2 13.34,19.68 13.06,19.96 13.06,20.55
VIN_PIN
  Top 0.254: PIN_PWR.P$2 17.8,18.41 16.64,18.41 15.88,19.18 15.88,20.19 15.49,20.57 FB2.2
XIN
  Top 0.152: IC1.45 7.84,13.17 7.51,12.84 7.51,12.48 7.35,12.32 6.48,12.32 6.38,12.41 C4.2
  Top 0.254: C4.2 5.71,12.83 5.5,13.04 5.5,13.52 XTAL1.1
XOUT
  Top 0.127: IC1.44 7.43,13.52 7.43,15.75 7.3,15.88 C5.2 6.95,15.19 XTAL1.3

### Text on the board
bPlace: GND | GND | RX/IO3 | VIN | TX/IO1 | 3V3 | IO26=R | BOOT | IO4=G | IO5=B | MTMS/IO14 | MTDO/IO15 | FemtoBeacon | MTDI/IO12 | ESP32 Coin | MTCK/IO13 | IO35 | 3V3 | IO34 | GND | EN | 1.0.1
Measures: Coin is 18mm dia.